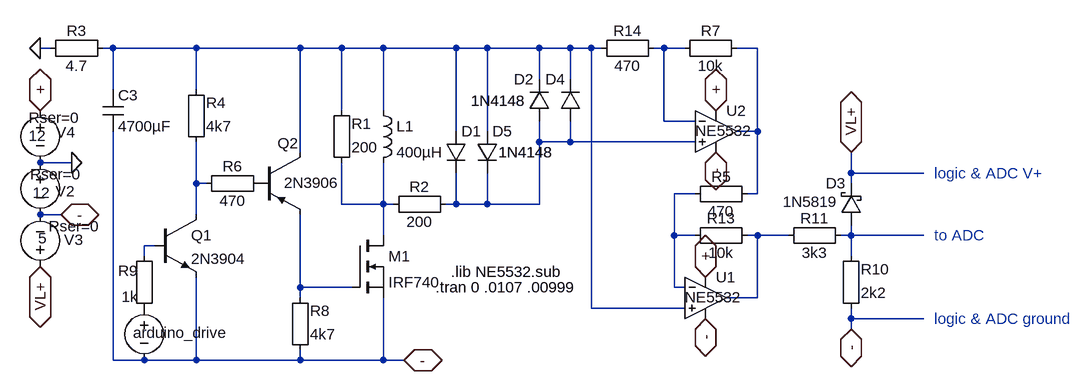
[diagram p0: schematic meat_haw_200.asc]
meat_haw_200.asc, the LTspice schematic file:
Version 4
SHEET 1 4676 1612
WIRE 0 -2400 -16 -2400
WIRE 96 -2400 80 -2400
WIRE 224 -2400 96 -2400
WIRE 384 -2400 224 -2400
WIRE 448 -2400 384 -2400
WIRE 512 -2400 448 -2400
WIRE 624 -2400 512 -2400
WIRE 672 -2400 624 -2400
WIRE 752 -2400 672 -2400
WIRE 800 -2400 752 -2400
WIRE 832 -2400 800 -2400
WIRE 848 -2400 832 -2400
WIRE 944 -2400 928 -2400
WIRE 976 -2400 944 -2400
WIRE 1088 -2400 1056 -2400
WIRE 752 -2352 752 -2400
WIRE 800 -2352 800 -2400
WIRE 96 -2336 96 -2400
WIRE 224 -2336 224 -2400
WIRE 448 -2304 448 -2400
WIRE 512 -2304 512 -2400
WIRE 944 -2288 944 -2400
WIRE 992 -2288 944 -2288
WIRE 624 -2272 624 -2400
WIRE 672 -2272 672 -2400
WIRE 1088 -2272 1088 -2400
WIRE 1088 -2272 1056 -2272
WIRE 752 -2256 752 -2288
WIRE 800 -2256 800 -2288
WIRE 800 -2256 752 -2256
WIRE 992 -2256 800 -2256
WIRE 384 -2240 384 -2400
WIRE 32 -2224 -16 -2224
WIRE 1232 -2208 1232 -2240
WIRE 1344 -2208 1232 -2208
WIRE 224 -2192 224 -2256
WIRE 240 -2192 224 -2192
WIRE 1232 -2192 1232 -2208
WIRE 992 -2176 960 -2176
WIRE 1088 -2176 1088 -2272
WIRE 1088 -2176 1072 -2176
WIRE 448 -2160 448 -2224
WIRE 512 -2160 512 -2224
WIRE 512 -2160 448 -2160
WIRE 528 -2160 512 -2160
WIRE 624 -2160 624 -2208
WIRE 624 -2160 608 -2160
WIRE 672 -2160 672 -2208
WIRE 672 -2160 624 -2160
WIRE 752 -2160 752 -2256
WIRE 752 -2160 672 -2160
WIRE 16 -2144 -16 -2144
WIRE 224 -2144 224 -2192
WIRE 512 -2112 512 -2160
WIRE 960 -2112 960 -2176
WIRE 992 -2112 960 -2112
WIRE 1088 -2112 1072 -2112
WIRE 1136 -2112 1088 -2112
WIRE 1232 -2112 1232 -2128
WIRE 1232 -2112 1216 -2112
WIRE 1344 -2112 1232 -2112
WIRE 160 -2096 144 -2096
WIRE 144 -2080 144 -2096
WIRE 1232 -2080 1232 -2112
WIRE 384 -2032 384 -2144
WIRE 464 -2032 384 -2032
WIRE 960 -2032 960 -2112
WIRE 976 -2032 960 -2032
WIRE 384 -2016 384 -2032
WIRE 1088 -2016 1088 -2112
WIRE 1088 -2016 1040 -2016
WIRE 832 -2000 832 -2400
WIRE 976 -2000 832 -2000
WIRE 1232 -1984 1232 -2000
WIRE 1344 -1984 1232 -1984
WIRE 1232 -1968 1232 -1984
WIRE 96 -1920 96 -2272
WIRE 144 -1920 96 -1920
WIRE 224 -1920 224 -2048
WIRE 224 -1920 144 -1920
WIRE 384 -1920 384 -1936
WIRE 384 -1920 224 -1920
WIRE 512 -1920 512 -2016
WIRE 512 -1920 384 -1920
WIRE 544 -1920 512 -1920
FLAG 544 -1920 -
IOPIN 544 -1920 BiDir
FLAG 16 -2144 -
IOPIN 16 -2144 BiDir
FLAG -16 -2304 +
IOPIN -16 -2304 BiDir
FLAG 32 -2224 0
FLAG -16 -2400 0
FLAG -16 -2064 VL+
IOPIN -16 -2064 BiDir
FLAG 1024 -2304 +
IOPIN 1024 -2304 BiDir
FLAG 1024 -2240 -
IOPIN 1024 -2240 BiDir
FLAG 1008 -2048 +
IOPIN 1008 -2048 BiDir
FLAG 1008 -1984 -
IOPIN 1008 -1984 BiDir
FLAG 1232 -1968 -
IOPIN 1232 -1968 BiDir
FLAG 1232 -2240 VL+
IOPIN 1232 -2240 BiDir
SYMBOL Misc\\EuropeanCap 80 -2336 R0
SYMATTR InstName C3
SYMATTR Value 4700µF
SYMATTR SpiceLine V=400 Irms=1 Rser=.32 Lser=0
SYMBOL ind 496 -2320 R0
SYMATTR InstName L1
SYMATTR Value 400µH
SYMBOL Misc\\EuropeanResistor 432 -2208 M180
WINDOW 0 31 76 Left 2
WINDOW 3 31 40 Left 2
SYMATTR InstName R1
SYMATTR Value 200
SYMBOL Misc\\EuropeanResistor 512 -2176 M90
WINDOW 0 5 56 VBottom 2
WINDOW 3 27 56 VTop 2
SYMATTR InstName R2
SYMATTR Value 200
SYMBOL diode 608 -2272 R0
WINDOW 3 81 32 Left 2
SYMATTR InstName D1
SYMATTR Value 1N4148
SYMBOL diode 768 -2288 R180
WINDOW 0 24 64 Left 2
WINDOW 3 36 31 Left 2
SYMATTR InstName D2
SYMATTR Value 1N4148
SYMBOL Misc\\EuropeanResistor -16 -2416 M90
WINDOW 0 5 56 VBottom 2
WINDOW 3 27 56 VTop 2
SYMATTR InstName R3
SYMATTR Value 4.7
SYMBOL nmos 464 -2112 R0
SYMATTR InstName M1
SYMATTR Value IRF740
SYMBOL voltage 144 -2016 M0
WINDOW 0 -130 54 Left 2
WINDOW 3 -134 119 Invisible 2
SYMATTR SpiceLine Rser=0
SYMATTR InstName arduino_drive
SYMATTR Value PULSE(0 4 .01 0 0 .00025 .1 1000)
SYMBOL voltage -16 -2240 M0
WINDOW 123 0 0 Left 2
WINDOW 39 -63 34 Left 2
WINDOW 0 -53 60 Left 2
WINDOW 3 -15 62 Left 2
SYMATTR SpiceLine Rser=0
SYMATTR InstName V2
SYMATTR Value 12
SYMBOL voltage -16 -2320 M0
WINDOW 123 0 0 Left 2
WINDOW 39 -61 27 Left 2
WINDOW 0 -54 49 Left 2
WINDOW 3 -9 55 Left 2
SYMATTR SpiceLine Rser=0
SYMATTR InstName V4
SYMATTR Value 12
SYMBOL voltage -16 -2048 M180
WINDOW 123 0 0 Left 2
WINDOW 39 13 78 Left 2
WINDOW 0 37 57 Left 2
WINDOW 3 -3 60 Left 2
SYMATTR SpiceLine Rser=0
SYMATTR InstName V3
SYMATTR Value 5
SYMBOL npn3 160 -2144 R0
SYMATTR InstName Q1
SYMATTR Value 2N3904
SYMBOL Misc\\EuropeanResistor 208 -2240 M180
WINDOW 0 31 76 Left 2
WINDOW 3 31 40 Left 2
SYMATTR InstName R4
SYMATTR Value 4k7
SYMBOL pnp2 320 -2240 R0
WINDOW 0 29 -14 Left 2
WINDOW 3 39 47 Left 2
SYMATTR InstName Q2
SYMATTR Value 2N3906
SYMBOL Misc\\EuropeanResistor 368 -1920 M180
WINDOW 0 31 76 Left 2
WINDOW 3 31 40 Left 2
SYMATTR InstName R8
SYMATTR Value 4k7
SYMBOL Misc\\EuropeanResistor 128 -1984 M180
WINDOW 0 -24 74 Left 2
WINDOW 3 -19 34 Left 2
SYMATTR InstName R9
SYMATTR Value 1k
SYMBOL Misc\\EuropeanResistor 224 -2208 M90
WINDOW 0 5 56 VBottom 2
WINDOW 3 27 56 VTop 2
SYMATTR InstName R6
SYMATTR Value 470
SYMBOL Opamps\\opamp2 1024 -2336 R0
WINDOW 3 -32 63 Left 2
SYMATTR Value NE5532
SYMATTR InstName U2
SYMBOL Misc\\EuropeanResistor 976 -2096 R270
WINDOW 0 27 56 VTop 2
WINDOW 3 5 56 VBottom 2
SYMATTR InstName R13
SYMATTR Value 10k
SYMBOL Misc\\EuropeanResistor 832 -2384 R270
WINDOW 0 27 56 VTop 2
WINDOW 3 5 56 VBottom 2
SYMATTR InstName R14
SYMATTR Value 470
SYMBOL Opamps\\opamp2 1008 -2080 R0
WINDOW 3 -32 63 Left 2
SYMATTR Value NE5532
SYMATTR InstName U1
SYMBOL Misc\\EuropeanResistor 1088 -2192 R90
WINDOW 0 5 56 VBottom 2
WINDOW 3 27 56 VTop 2
SYMATTR InstName R5
SYMATTR Value 470
SYMBOL Misc\\EuropeanResistor 960 -2384 R270
WINDOW 0 27 56 VTop 2
WINDOW 3 5 56 VBottom 2
SYMATTR InstName R7
SYMATTR Value 10k
SYMBOL Misc\\EuropeanResistor 1120 -2096 R270
WINDOW 0 27 56 VTop 2
WINDOW 3 5 56 VBottom 2
SYMATTR InstName R11
SYMATTR Value 3k3
SYMBOL Misc\\EuropeanResistor 1216 -1984 M180
WINDOW 0 31 76 Left 2
WINDOW 3 31 40 Left 2
SYMATTR InstName R10
SYMATTR Value 2k2
SYMBOL schottky 1248 -2128 R180
WINDOW 0 24 64 Left 2
WINDOW 3 36 36 Left 2
SYMATTR InstName D3
SYMATTR Value 1N5819
SYMATTR Description Diode
SYMATTR Type diode
SYMBOL diode 816 -2288 R180
WINDOW 0 24 64 Left 2
WINDOW 3 84 31 Left 2
SYMATTR InstName D4
SYMATTR Value 1N4148
SYMBOL diode 656 -2272 R0
WINDOW 3 33 32 Left 2
SYMATTR InstName D5
SYMATTR Value 1N4148
TEXT 592 -2032 Left 2 !.tran 0 .0107 .00999
TEXT 616 -2056 Left 2 !.lib NE5532.sub
TEXT 1360 -2112 Left 2 ;to ADC
TEXT 1360 -2208 Left 2 ;logic & ADC V+
TEXT 1360 -1984 Left 2 ;logic & ADC ground

The netlist it stands for:
* meat_haw_200.asc
C3 N001 - 4700µF V=400 Irms=1 Rser=.32 Lser=0
L1 N001 N007 400µH
R1 N007 N001 200
R2 N007 N004 200
D1 N001 N004 1N4148
D2 N004 N001 1N4148
R3 0 N001 4.7
M1 N007 N011 - - IRF740
V§arduino_drive P001 - PULSE(0 4 .01 0 0 .00025 .1 1000) Rser=0
V2 0 - 12 Rser=0
V4 + 0 12 Rser=0
V3 VL+ - 5 Rser=0
Q1 N005 N010 - 0 2N3904
R4 N005 N001 4k7
Q2 N001 P002 N011 0 2N3906
R8 - N011 4k7
R9 P001 N010 1k
R6 N005 P002 470
XU2 N004 N002 + - N003 NE5532  ; pins In+ In- V+ V- OUT
R13 N006 N008 10k
R14 N001 N002 470
XU1 N001 N006 + - N008 NE5532  ; pins In+ In- V+ V- OUT
R5 N003 N006 470
R7 N002 N003 10k
R11 N008 N009 3k3
R10 - N009 2k2
D3 N009 VL+ 1N5819
D4 N004 N001 1N4148
D5 N001 N004 1N4148
.model D D
.lib standard.dio
.model NPN NPN
.model PNP PNP
.lib standard.bjt
.model NMOS NMOS
.model PMOS PMOS
.lib standard.mos
.tran 0 .0107 .00999
.lib NE5532.sub
* to ADC
* logic & ADC V+
* logic & ADC ground
.backanno
.end